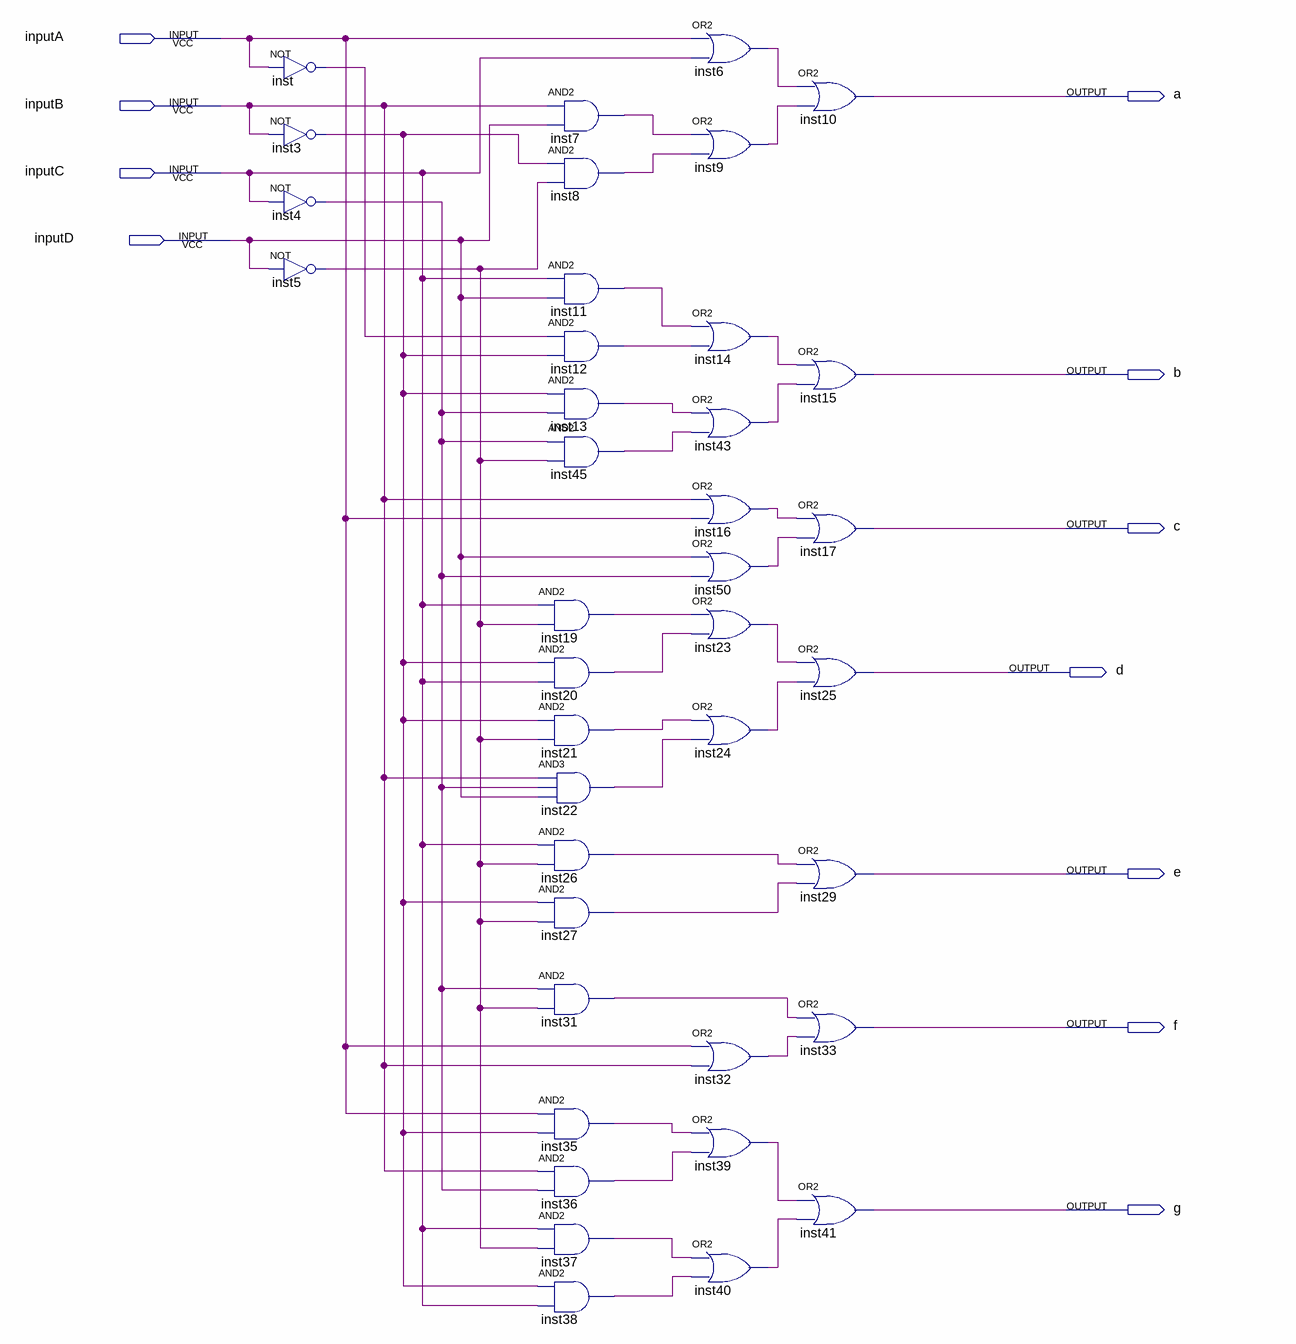
[diagram p0: schematic sheet]
// Quartus schematic segementdecoder7.bdf as structural Verilog: 39 symbols, 11 pins
module segementdecoder7 (
  input  inputA,
  input  inputB,
  input  inputC,
  input  inputD,
  output a,
  output b,
  output c,
  output d,
  output e,
  output f,
  output g
);

  wire inst3_out, inst4_out, inst5_out, inst6_out, inst7_out, inst8_out, inst9_out, inst11_out, inst12_out,
       inst13_out, inst14_out, inst16_out, inst19_out, inst20_out, inst21_out, inst22_out, inst23_out,
       inst24_out, inst26_out, inst27_out, inst31_out, inst32_out, inst35_out, inst36_out, inst37_out,
       inst38_out, inst39_out, inst40_out, inst43_out, inst45_out, inst50_out, inst_out;

  not inst (inst_out, inputA);
  not inst3 (inst3_out, inputB);
  not inst4 (inst4_out, inputC);
  not inst5 (inst5_out, inputD);
  and inst7 (inst7_out, inputB, inputD);
  and inst8 (inst8_out, inst3_out, inst5_out);
  and inst11 (inst11_out, inputC, inputD);
  and inst12 (inst12_out, inst_out, inst3_out);
  and inst13 (inst13_out, inst3_out, inst4_out);
  and inst45 (inst45_out, inst4_out, inst5_out);
  and inst19 (inst19_out, inputC, inst5_out);
  and inst20 (inst20_out, inst3_out, inputC);
  and inst21 (inst21_out, inst3_out, inst5_out);
  and inst22 (inst22_out, inputB, inst4_out, inputD);
  and inst26 (inst26_out, inputC, inst5_out);
  and inst27 (inst27_out, inst3_out, inst5_out);
  and inst31 (inst31_out, inst4_out, inst5_out);
  and inst35 (inst35_out, inputA, inst3_out);
  and inst36 (inst36_out, inputB, inst4_out);
  and inst37 (inst37_out, inputC, inst5_out);
  and inst38 (inst38_out, inst3_out, inputC);
  or inst6 (inst6_out, inputA, inputC);
  or inst9 (inst9_out, inst7_out, inst8_out);
  or inst14 (inst14_out, inst11_out, inst12_out);
  or inst43 (inst43_out, inst13_out, inst45_out);
  or inst16 (inst16_out, inputB, inputA);
  or inst50 (inst50_out, inputD, inst4_out);
  or inst23 (inst23_out, inst19_out, inst20_out);
  or inst24 (inst24_out, inst21_out, inst22_out);
  or inst32 (inst32_out, inputA, inputB);
  or inst39 (inst39_out, inst35_out, inst36_out);
  or inst40 (inst40_out, inst37_out, inst38_out);
  or inst10 (a, inst6_out, inst9_out);
  or inst15 (b, inst14_out, inst43_out);
  or inst17 (c, inst16_out, inst50_out);
  or inst25 (d, inst23_out, inst24_out);
  or inst29 (e, inst26_out, inst27_out);
  or inst33 (f, inst31_out, inst32_out);
  or inst41 (g, inst39_out, inst40_out);
endmodule
